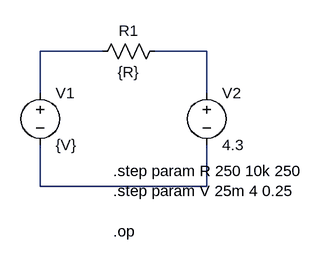
[diagram p0: schematic Draft1.asc]
Draft1.asc, the LTspice schematic file:
Version 4.1
SHEET 1 880 680
WIRE 160 80 64 80
WIRE 320 80 240 80
WIRE 64 144 64 80
WIRE 320 144 320 80
WIRE 64 288 64 224
WIRE 320 288 320 224
WIRE 320 288 64 288
SYMBOL voltage 64 128 R0
WINDOW 123 0 0 Left 0
WINDOW 39 0 0 Left 0
SYMATTR InstName V1
SYMATTR Value {V}
SYMBOL voltage 320 128 R0
SYMATTR InstName V2
SYMATTR Value 4.3
SYMBOL res 256 64 R90
WINDOW 0 0 56 VBottom 2
WINDOW 3 32 56 VTop 2
SYMATTR InstName R1
SYMATTR Value {R}
TEXT 176 264 Left 2 !.step param R 250 10k 250\n.step param V 25m 4 0.25\n \n.op

The netlist it stands for:
* Draft1.asc
V1 N001 N003 {V}
V2 N002 N003 4.3
R1 N002 N001 {R}
.step param R 250 10k 250
.step param V 25m 4 0.25
.op
.backanno
.end